# Altium schematic sheet USB_Isolator.SchDoc: USB Isolator by Harsha
size 431 x 279 mm; DrawnBy: Harsha Sandirigama; Engineer: Harsha Sandirigama; DocumentNumber: 1.0; Revision: 1.0; SheetNumber: 1; SheetTotal: 3; Project: USB Isolator; ENG_APP_DATE: --/--/--; DSN_APP_DATE: --/--/--; CHK_APP_DATE: --/--/--
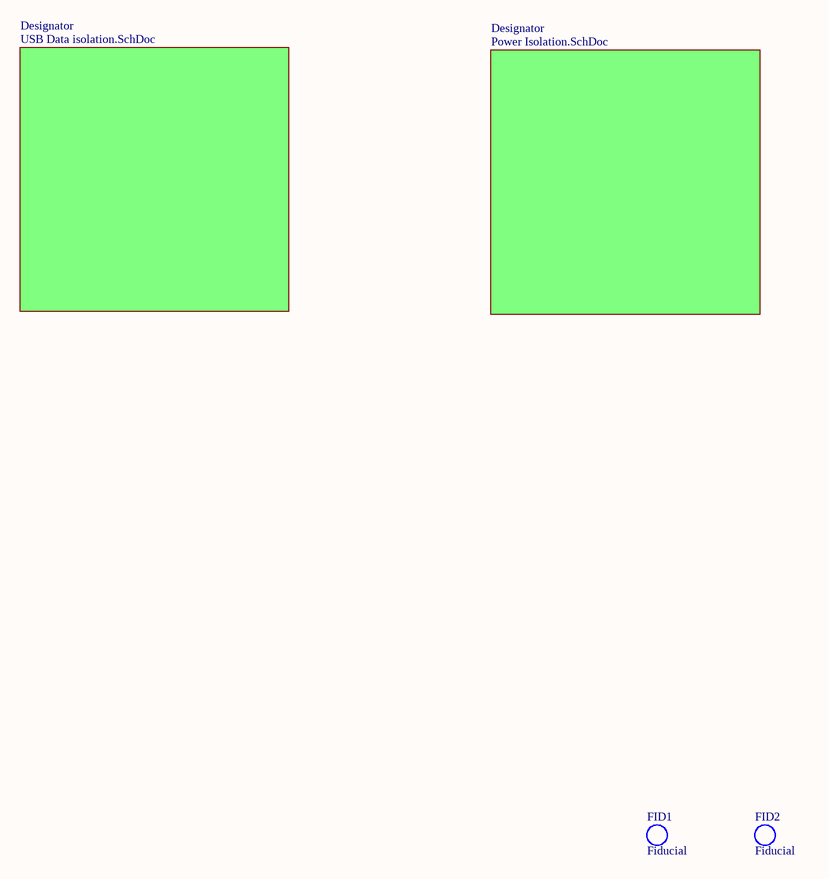
[diagram p0: USB_Isolator.SchDoc]

## Parts
FID1  Fiducial  [FID_0.5mm]  (no BOM)
FID2  Fiducial  [FID_0.5mm]  (no BOM)

## Sub-sheets
Designator = USB Data isolation.SchDoc: no entries
Designator = Power Isolation.SchDoc: no entries

## Notes on the sheet
- DWG. NO.
- REV.
- SHT.
- THIS DOCUMENT AND THE DATA DISCLOSED HEREIN OR HEREWITH IS THE PROPERTY OF ALTIUM LIMITED AND MAY BE FREELY DISTRIBUTED IN WHOLE. NO RIGHTS ARE RESERVED OR EXPRESS OR IMPLIED WARANTEE GIVEN.
- REVISION
- DESCRIPTION
- DATE
- APPROVED
- ENG:
- APPROVALS
- PROJECT
- DSN:
- CHK:
- REFERENCE DOCUMENTS
- PROJECT REVISION:
- TITLE
- DOCUMENT REVISION:
- DESIGN ITEM:
- BOM:
- FAB DWG:
- PCB DWG:
- ASSY DWG:
- SCALE:
- SIZE
- B
- CAGE CODE
- FILE NAME
- DWG NO.
- SHEET
- OF
- REV

## Library data of the parts
FID1 FID2 = Fiducial_0.5mm